# EAGLE schematic PDM (EAGLE 8.3.2)
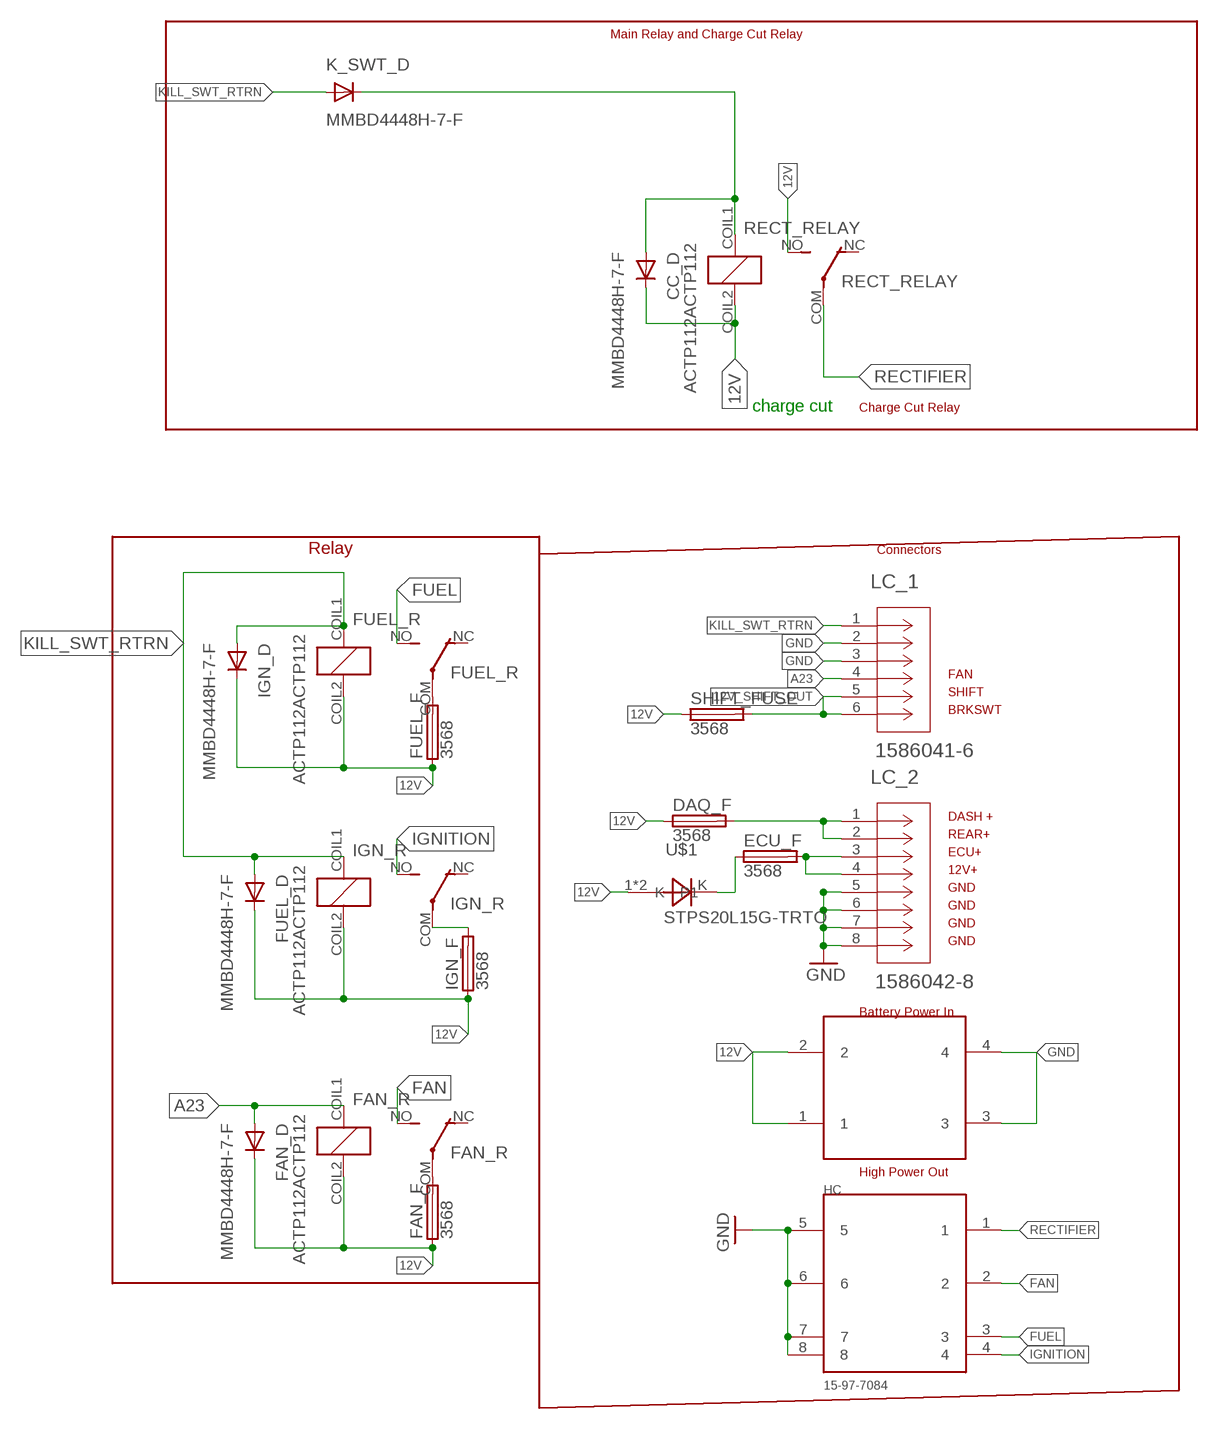
[diagram p0: schematic, sheet 1]

## Parts
BAT_SUP  15-97-8043  [15-97-8043]
CC_D  MMBD4448H-7-F  [SOT23-3]
DAQ_F  3568  [3568]
ECU_F  3568  [3568]
FAN_D  MMBD4448H-7-F  [SOT23-3]
FAN_F  3568  [3568]
FAN_R  ACTP112ACTP112  [ACTP112]
FUEL_D  MMBD4448H-7-F  [SOT23-3]
FUEL_F  3568  [3568]
FUEL_R  ACTP112ACTP112  [ACTP112]
HC  15-97-7084  [15-97-7084]
IGN_D  MMBD4448H-7-F  [SOT23-3]
IGN_F  3568  [3568]
IGN_R  ACTP112ACTP112  [ACTP112]
K_SWT_D  MMBD4448H-7-F  [SOT23-3]
LC_1  1586041-6  [1586041-6]
LC_2  1586042-8  [1586042-8]
RECT_RELAY  ACTP112ACTP112  [ACTP112]
SHIFT_FUSE  3568  [3568]
U$1  STPS20L15G-TRTO  [TO-262DIODE]

## Nets
12V: BAT_SUP.1 BAT_SUP.2 CC_D.3(C) DAQ_F.1 DAQ_F.2 FAN_D.3(C) FAN_F.1 FAN_F.2 FAN_R.COIL2 FUEL_D.3(C) FUEL_F.1 FUEL_F.2 FUEL_R.COIL2 IGN_D.3(C) IGN_F.1 IGN_F.2 IGN_R.COIL2 RECT_RELAY.COIL2 RECT_RELAY.NO SHIFT_FUSE.1 SHIFT_FUSE.2 U$1.1 U$1.2(P1)
12V_DAQ_OUT: DAQ_F.3 DAQ_F.4 LC_2.1 LC_2.2
12V_FUSED_ECU: ECU_F.3 ECU_F.4 LC_2.3 LC_2.4
12V_SHIFT_OUT: LC_1.5 LC_1.6 SHIFT_FUSE.3 SHIFT_FUSE.4
A23: FAN_D.1(A) FAN_R.COIL1 LC_1.4
ECU_PROTECTED: ECU_F.1 ECU_F.2 U$1.K
FAN: FAN_R.NO HC.2
FAN_12V: FAN_F.3 FAN_F.4 FAN_R.COM
FUEL: FUEL_R.NO HC.3
FUEL_12V: FUEL_F.3 FUEL_F.4 FUEL_R.COM
GND: BAT_SUP.3 BAT_SUP.4 HC.5 HC.6 HC.7 HC.8 LC_1.2 LC_1.3 LC_2.5 LC_2.6 LC_2.7 LC_2.8
IGN_12V: IGN_F.3 IGN_F.4 IGN_R.COM
IGNITION: HC.4 IGN_R.NO
KILL_SWITCH_DIODE: CC_D.1(A) K_SWT_D.3(C) RECT_RELAY.COIL1
KILL_SWT_RTRN: FUEL_D.1(A) FUEL_R.COIL1 IGN_D.1(A) IGN_R.COIL1 K_SWT_D.1(A) LC_1.1
RECTIFIER: HC.1 RECT_RELAY.COM
Unconnected: FAN_R.NC FUEL_R.NC IGN_R.NC RECT_RELAY.NC

## Notes on the sheet
- Main Relay and Charge Cut Relay
- charge cut | Charge Cut Relay
- Relay | Connectors
- FAN
- SHIFT
- BRKSWT
- DASH +
- REAR+
- ECU+
- 12V+
- GND
- GND
- GND
- GND
- Battery Power In
- High Power Out

## Library data of the parts
BAT_SUP = molex:15-97-8043
CC_D FAN_D FUEL_D IGN_D K_SWT_D = diodes-inc:MMBD4448H-7-F
DAQ_F ECU_F FAN_F FUEL_F IGN_F SHIFT_FUSE = Keystone:3568: Mini ATC Fuse Holder 20A 500V 1 Circuit Blade PCB
FAN_R FUEL_R IGN_R RECT_RELAY = panasonic:ACTP112: ACTP112 Through-Hole Micro Relay
HC = molex:15-97-7084
LC_1 = BMS Lbr:1586041-6: TE VAL-U-LOK TPA 6 Pin Header
LC_2 = BMS Lbr:1586042-8: 1586042-8 8 pin Val-U-Lock TPA
U$1 = st-microelectronics:STPS20L15G-TR